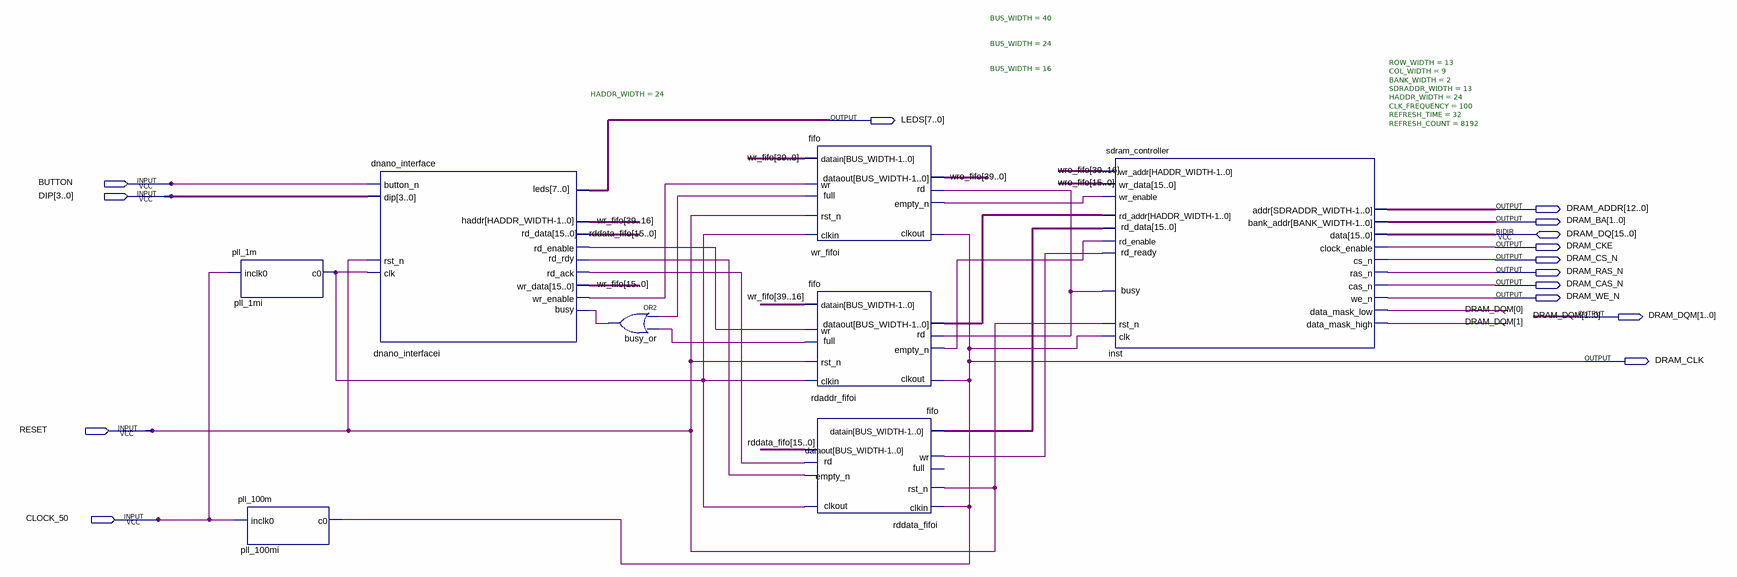
[diagram p0: schematic sheet]
// Quartus schematic toplevel.bdf as structural Verilog: 8 symbols, 15 pins
module toplevel (
  input  BUTTON,
  input  [3:0] DIP,
  input  RESET,
  input  CLOCK_50,
  inout  [15:0] DRAM_DQ,
  output [7:0] LEDS,
  output [12:0] DRAM_ADDR,
  output [1:0] DRAM_BA,
  output DRAM_CKE,
  output DRAM_CS_N,
  output DRAM_RAS_N,
  output DRAM_CAS_N,
  output DRAM_WE_N,
  output [1:0] DRAM_DQM,
  output DRAM_CLK
);

  wire busy_or_out, dnano_interfacei_rd_ack, dnano_interfacei_rd_enable, dnano_interfacei_wr_enable,
       inst_busy, inst_rd_ready, pll_1mi_c0, rdaddr_fifoi_empty_n, rdaddr_fifoi_full, rddata_fifoi_empty_n,
       wr_fifoi_empty_n, wr_fifoi_full;
  wire [15:0] inst_rd_data, rddata_fifo;
  wire [23:0] rdaddr_fifoi_dataout;
  wire [39:0] wr_fifo, wro_fifo;

  pll_1m pll_1mi (.inclk0(CLOCK_50), .c0(pll_1mi_c0));
  pll_100m pll_100mi (.inclk0(CLOCK_50), .c0(DRAM_CLK));
  dnano_interface #(.HADDR_WIDTH(24)) dnano_interfacei (
    .button_n(BUTTON), .dip(DIP), .busy(busy_or_out), .rd_data(rddata_fifo), .rd_rdy(rddata_fifoi_empty_n),
    .rst_n(RESET), .clk(pll_1mi_c0), .leds(LEDS), .haddr(wr_fifo[39:16]),
    .wr_enable(dnano_interfacei_wr_enable), .wr_data(wr_fifo[15:0]), .rd_enable(dnano_interfacei_rd_enable),
    .rd_ack(dnano_interfacei_rd_ack));
  or busy_or (busy_or_out, wr_fifoi_full, rdaddr_fifoi_full);
  fifo #(.BUS_WIDTH(40)) wr_fifoi (
    .datain(wr_fifo), .clkin(pll_1mi_c0), .clkout(DRAM_CLK), .wr(dnano_interfacei_wr_enable), .rd(inst_busy),
    .rst_n(RESET), .dataout(wro_fifo), .full(wr_fifoi_full), .empty_n(wr_fifoi_empty_n));
  fifo #(.BUS_WIDTH(24)) rdaddr_fifoi (
    .datain(wr_fifo[39:16]), .clkin(pll_1mi_c0), .clkout(DRAM_CLK), .wr(dnano_interfacei_rd_enable),
    .rd(inst_busy), .rst_n(RESET), .dataout(rdaddr_fifoi_dataout), .full(rdaddr_fifoi_full),
    .empty_n(rdaddr_fifoi_empty_n));
  fifo #(.BUS_WIDTH(16)) rddata_fifoi (
    .datain(inst_rd_data), .clkin(DRAM_CLK), .clkout(pll_1mi_c0), .wr(inst_rd_ready),
    .rd(dnano_interfacei_rd_ack), .rst_n(RESET), .dataout(rddata_fifo), .empty_n(rddata_fifoi_empty_n));  // open: full
  sdram_controller #(.ROW_WIDTH(13), .COL_WIDTH(9), .BANK_WIDTH(2), .SDRADDR_WIDTH(13), .HADDR_WIDTH(24), .CLK_FREQUENCY(100), .REFRESH_TIME(32), .REFRESH_COUNT(8192)) inst (
    .wr_addr(wro_fifo[39:16]), .wr_data(wro_fifo[15:0]), .wr_enable(wr_fifoi_empty_n),
    .rd_addr(rdaddr_fifoi_dataout), .rd_enable(rdaddr_fifoi_empty_n), .rst_n(RESET), .clk(DRAM_CLK),
    .rd_data(inst_rd_data), .rd_ready(inst_rd_ready), .busy(inst_busy), .addr(DRAM_ADDR),
    .bank_addr(DRAM_BA), .clock_enable(DRAM_CKE), .cs_n(DRAM_CS_N), .ras_n(DRAM_RAS_N), .cas_n(DRAM_CAS_N),
    .we_n(DRAM_WE_N), .data_mask_low(DRAM_DQM[0]), .data_mask_high(DRAM_DQM[1]), .data(DRAM_DQ));
endmodule
